# Altium schematic sheet power_card_top.SchDoc
size A3
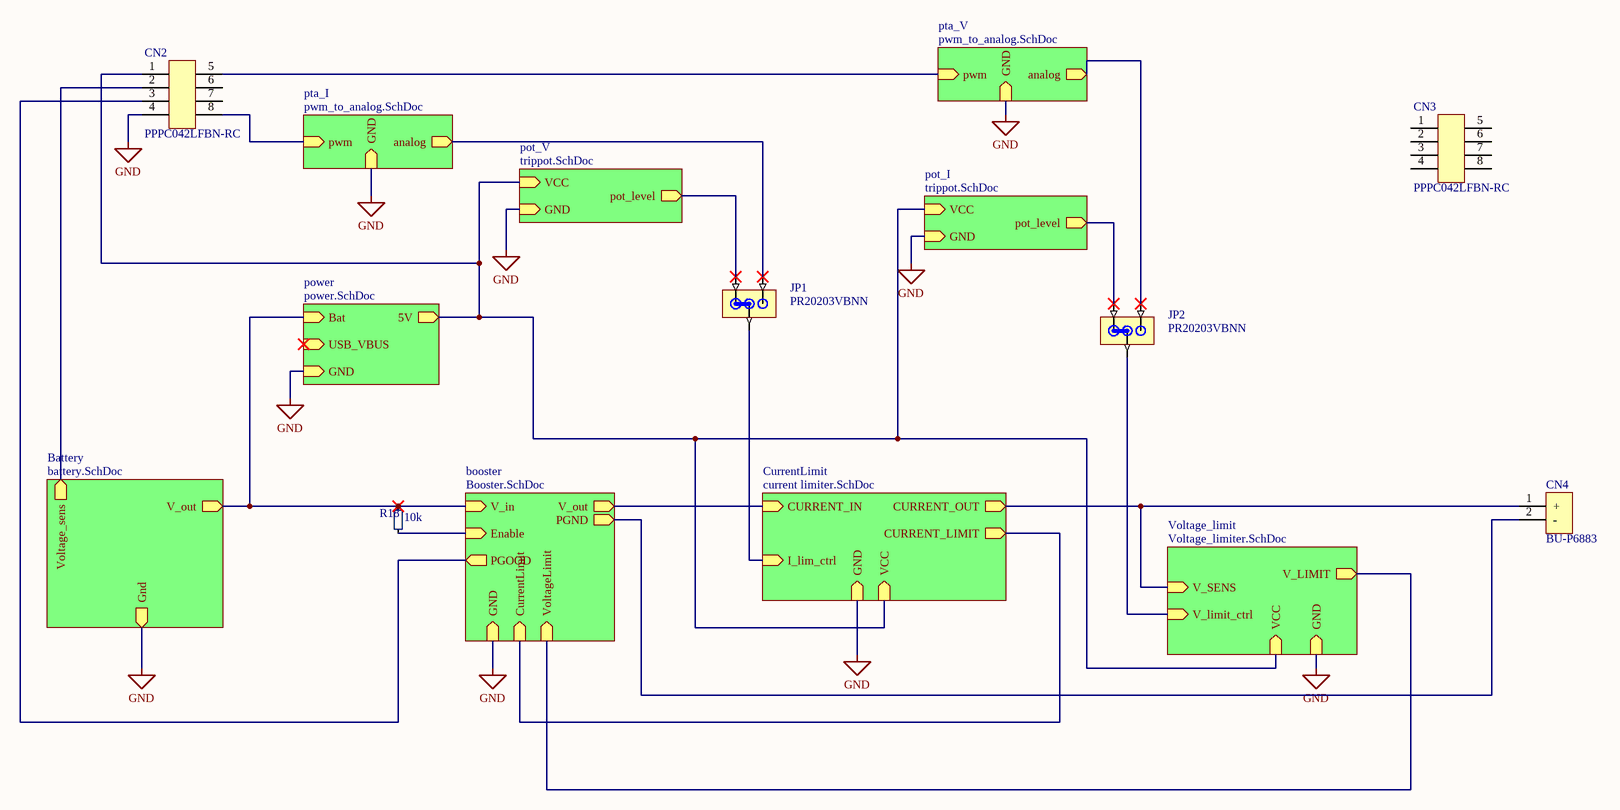
[diagram p0: power_card_top.SchDoc]

## Parts
CN2  PPPC042LFBN-RC  [PPPC042LFBN-RC-Footprint-1]
CN3  PPPC042LFBN-RC  [PPPC042LFBN-RC-Footprint-1]
CN4  BU-P6883  [6883-Footprint-1]
JP1  PR20203VBNN  [PR20203VBNN-Footprint-1]
JP2  PR20203VBNN  [PR20203VBNN-Footprint-1]
R18  Resistance: 10k  [SMD_0402(1005)_M]  (hidden comment: RC0402FR-0710KL)

## Sub-sheets
Battery = battery.SchDoc: V_out (out), Gnd (out), Voltage_sens (out)
booster = Booster.SchDoc: V_in (in), V_out (out), CurrentLimit (in), VoltageLimit (in), GND (in), PGND (out), PGOOD (out), Enable (in)
CurrentLimit = current limiter.SchDoc: CURRENT_IN (in), CURRENT_OUT (out), CURRENT_LIMIT (out), GND (in), VCC (in), I_lim_ctrl (in)
pot_I = trippot.SchDoc: GND (in), VCC (in), pot_level (out)
pot_V = trippot.SchDoc: GND (in), VCC (in), pot_level (out)
power = power.SchDoc: Bat (in), USB_VBUS (in), GND (in), 5V (out)
pta_I = pwm_to_analog.SchDoc: pwm (in), analog (out), GND (in)
pta_V = pwm_to_analog.SchDoc: pwm (in), analog (out), GND (in)
Voltage_limit = Voltage_limiter.SchDoc: V_SENS (in), V_LIMIT (out), V_limit_ctrl (in), VCC (in), GND (in)

## Nets
GND: CN2.4 ; sheet booster/GND, sheet CurrentLimit/GND, sheet Voltage_limit/GND, sheet Battery/Gnd, sheet pta_V/GND, sheet pot_V/GND, sheet pta_I/GND, sheet pot_I/GND, sheet power/GND
NetCN2_1: CN2.1 ; sheet CurrentLimit/VCC, sheet Voltage_limit/VCC, sheet pot_V/VCC, sheet pot_I/VCC, sheet power/5V
NetCN2_2: CN2.2 ; sheet Battery/Voltage_sens
NetCN2_3: CN2.3 ; sheet booster/PGOOD
NetCN2_5: CN2.5 ; sheet pta_V/pwm
NetCN2_8: CN2.8 ; sheet pta_I/pwm
NetCN4_1: CN4.1(+) ; sheet CurrentLimit/CURRENT_OUT, sheet Voltage_limit/V_SENS
NetCN4_2: CN4.2(-) ; sheet booster/PGND
NetJP1_1: JP1.1 ; sheet pot_V/pot_level
NetJP1_2: JP1.2 ; sheet CurrentLimit/I_lim_ctrl
NetJP1_3: JP1.3 ; sheet pta_I/analog
NetJP2_1: JP2.1 ; sheet pot_I/pot_level
NetJP2_2: JP2.2 ; sheet Voltage_limit/V_limit_ctrl
NetJP2_3: JP2.3 ; sheet pta_V/analog
NetR18_1: R18.1 ; sheet booster/Enable
NetR18_2: R18.2 ; sheet booster/V_in, sheet Battery/V_out, sheet power/Bat
(unnamed): sheet booster/V_out, sheet CurrentLimit/CURRENT_IN
(unnamed): sheet booster/CurrentLimit, sheet CurrentLimit/CURRENT_LIMIT
(unnamed): sheet booster/VoltageLimit, sheet Voltage_limit/V_LIMIT

Not connected (* = marked no-connect by the designer): CN2 6 7; CN3 1 2 3 4 5 6 7 8

## Library data of the parts
CN2 CN3 = CMP-ROOT-00004-5: CONN HDR 8POS 0.1 GOLD PCB; Row Spacing: 0.1inch; Connector Type: Header,Socket; Number of Positions: 8; System: Connector; Packaging: Bulk; Width: 5mm; Contact Material: Bronze; Mount: Through Hole; Height: 8.5mm; Color: Black; RoHS: Yes; Package Quantity: 1000; Pitch: 0.1inch; Lead Free: Lead Free; Contact Plating: Gold; Housing Material: Plastic; Termination: Solder; Length: 10.7mm; Number of Rows: 2
CN4 = CMP-ROOT-00006-6: CONN BIND POST DL FLUTD BLK/RED; Number of Positions: 2; System: Connector; Color: Black,Red; Mount: TH; Termination: Turret; RoHS: Yes
JP1 JP2 = CMP-ROOT-00005-4: CONN HEADER VERT 3POS 2.54MM; System: Connector; Number of Positions: 3; Mount: TH; RoHS: Yes
R18 = CMP-008-0005-9: Surface Mount Thick Film Resistor, Rc Series, 10 Kohm, 62.5 Mw, - 1%, 50 V, 0402 [1005 Metric]; Voltage Rating (DC): 50V; Value: 10k; Temperature Coefficient: 100ppm/°C; Power Rating: 62.5mW; Lead Pitch: 0.2mm; Composition: Thick Film; Number of Terminations: 2; Number of Pins: 2; Military Standard: Not; Working Voltage: 50V; Length: 1mm; Packaging: Tape and Reel; Height: 0.32mm; Voltage Rating: 50V; Mount: SMD; Tolerance: 1%; Termination: SMD/SMT; Depth: 0.5mm; Min Operating Temperature: -55°C; RoHS: Yes; Case Code (Metric): 1005; Case Code (Imperial): 0402; Lead Free: Lead Free; Width: 0.5mm; Case/Package: 0402; REACH SVHC: No SVHC; Max Operating Temperature: 155°C